# Altium schematic sheet PCB_PROJECT_01.SchDoc
size A4; SheetNumber: 1; SheetTotal: 1
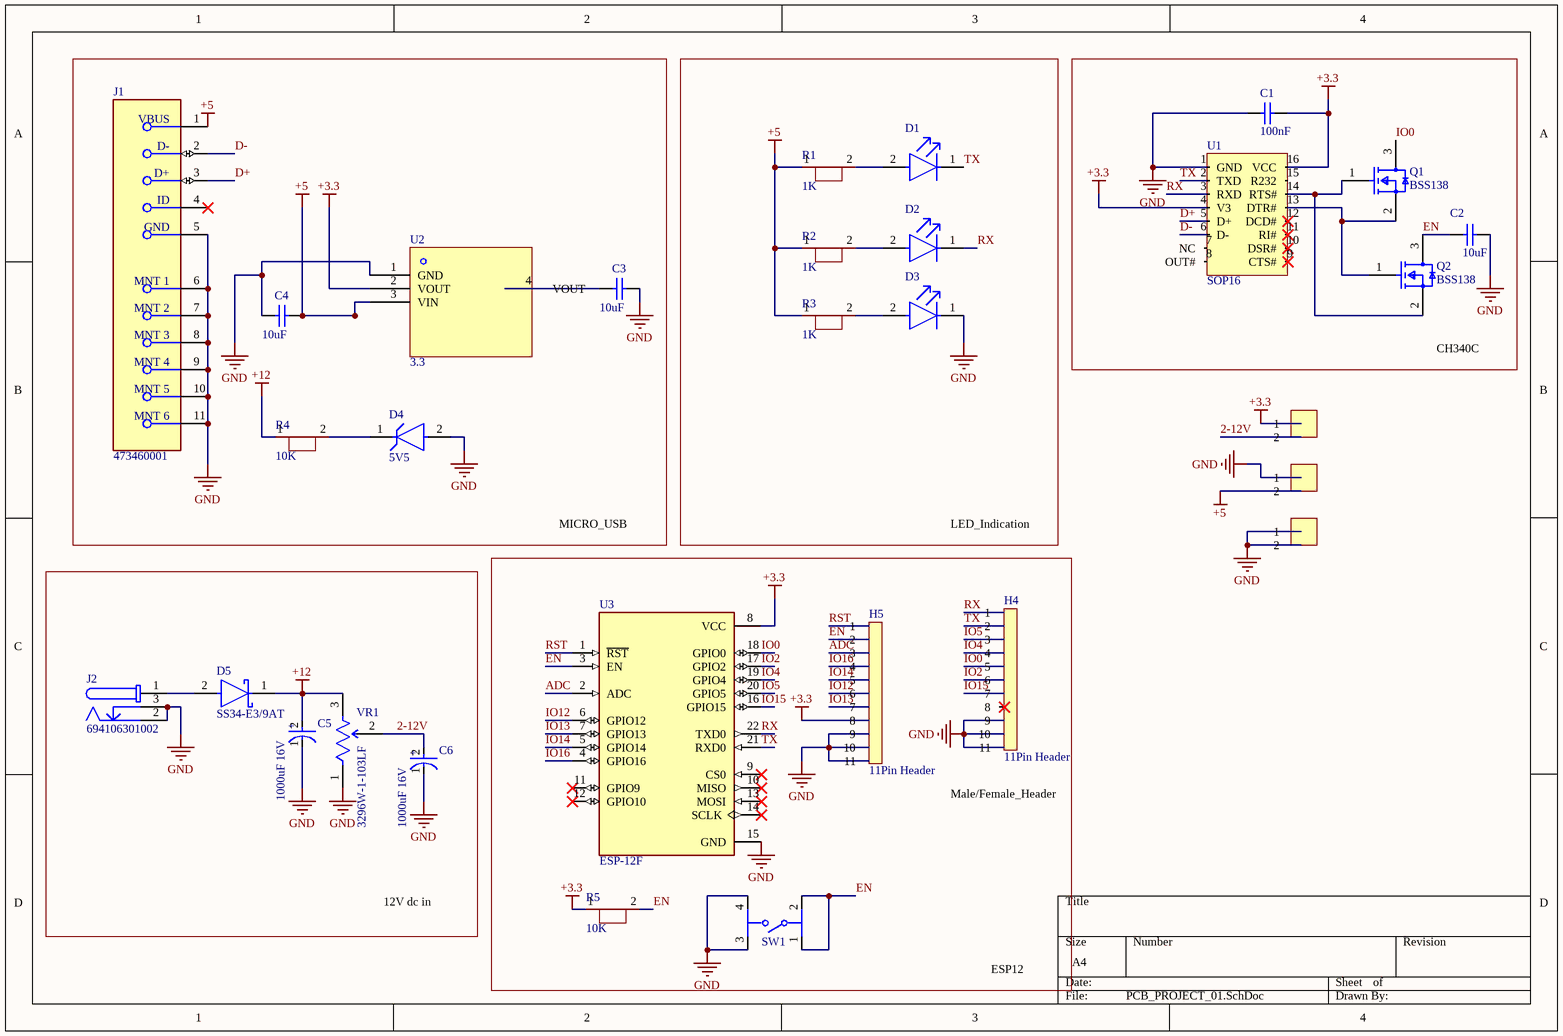
[diagram p0: PCB_PROJECT_01.SchDoc]

## Parts
C1  100nF  [CAPC0805(2012)145_M]
C2  10uF  [CAPC0805(2012)145_M]
C3  10uF  [CAPC0805(2012)100_L]
C4  10uF  [CAPC0805(2012)100_L]
C5  1000uF 16V  [FP-RAD-TH-D_10_0_5-L_16_1-MFG]
C6  1000uF 16V  [FP-RAD-TH-D_10_0_5-L_16_1-MFG]
D1  (no value)  [FP-SML-LX0603SIW-TR-MFG]
D2  SML-LX0603SIW-TR  [FP-SML-LX0603SIW-TR-MFG]  (value not drawn)
D3  SML-LX0603SIW-TR  [FP-SML-LX0603SIW-TR-MFG]  (value not drawn)
D4  5V5  [FP-SOD123-MFG]
D5  SS34-E3/9AT  [FP-SMC-MFG]
H1  HDR_2PIN  [HDR_2PIN]  (value not drawn)
H2  HDR_2PIN  [HDR_2PIN]  (value not drawn)
H3  HDR_2PIN  [HDR_2PIN]  (value not drawn)
H4  11Pin Header  [HDR_11PIN]
H5  11Pin Header  [HDR_11PIN]
J1  473460001  [FP-473460001-MFG]
J2  694106301002  [694106301002]
Q1  BSS138  [FP-318-08-IPC_B]
Q2  BSS138  [FP-318-08-IPC_B]
R1  1K  [RES0805]
R2  1K  [RES0805]
R3  1K  [RES0805]
R4  10K  [RES0805]
R5  10K  [RES0805]
SW1  B3F-1055  [FP-B3F-1055-MFG]  (value not drawn)
U1  SOP16  [CH340C]
U2  3.3  [AMS11173.3]
U3  ESP-12F  [XCVR_ESP-12F]
VR1  3296W-1-103LF  [FP-3296W-MFG]

## Nets
+3.3: C1.2 H1.1 H5.8 R5.1 U1.4(V3) U1.16(VCC) U2.2(VOUT) U3.8(VCC)
+5: C4.2 H2.2 J1.1(VBUS) R1.1 R2.1 R3.1 U2.3(VIN)
+12: C5.2(A) D5.1(C) R4.1 VR1.3(CW)
GND: C1.1 C2.2 C3.2 C4.1 C5.1(C) C6.1(C) D3.1(C) D4.2(A) H2.1 H3.1 H3.2 H4.9 H4.10 H4.11 H5.9 H5.10 H5.11 J1.5(GND) J1.6(MNT_1) J1.7(MNT_2) J1.8(MNT_3) J1.9(MNT_4) J1.10(MNT_5) J1.11(MNT_6) J2.2 J2.3 SW1.3 SW1.4 U1.1(GND) U2.1(GND) U3.15(GND) VR1.1(CCW)
2-12V: C6.2(A) H1.2 VR1.2(WIPER)
ADC: H5.3 U3.2(ADC)
D+: J1.3(D+) U1.5(D+)
D-: J1.2(D-) U1.6(D-)
EN: C2.1 H5.2 Q2.3(D) R5.2 SW1.1 SW1.2 U3.3(EN)
IO0: H4.5 Q1.3(D) U3.18(GPIO0)
IO2: H4.6 U3.17(GPIO2)
IO4: H4.4 U3.19(GPIO4)
IO5: H4.3 U3.20(GPIO5)
IO12: H5.6 U3.6(GPIO12)
IO13: H5.7 U3.7(GPIO13)
IO14: H5.5 U3.5(GPIO14)
IO15: H4.7 U3.16(GPIO15)
IO16: H5.4 U3.4(GPIO16)
RST: H5.1 U3.1(~{RST})
RX: D2.1(C) H4.1 U1.3(RXD) U3.22(TXD0)
TX: D1.1(C) H4.2 U1.2(TXD) U3.21(RXD0)
NetC3_1: C3.1 U2.4(VOUT)
NetD1_2: D1.2(A) R1.2
NetD2_2: D2.2(A) R2.2
NetD3_2: D3.2(A) R3.2
NetD4_1: D4.1(C) R4.2
NetD5_2: D5.2(A) J2.1
NetQ1_1: Q1.1(G) Q2.2(S) U1.14(RTS#)
NetQ1_2: Q1.2(S) Q2.1(G) U1.13(DTR#)

Not connected (* = marked no-connect by the designer): H4 8*; J1 4(ID)*; U1 7(NC) 8(OUT#) 9(CTS#)* 10(DSR#)* 11(RI#)* 12(DCD#)* 15(R232); U3 9(CS0)* 10(MISO)* 11(GPIO9)* 12(GPIO10)* 13(MOSI)* 14(SCLK)*

## Notes on the sheet
- (near Q2) CH340C
- MICRO_USB
- LED_Indication
- (near H4) Male/Female_Header
- 12V dc in
- ESP12
- (in symbol CMP-05427-001094-1) +

## Library data of the parts
C1 C2 = CMP-1036-04429-1: CAP 100nF 100V ±10% 0805 (2012 Metric) Thickness 1.45mm SMD; Tolerance: Â±10%; Case-Metric: 2012; Case-EIA: 0805; Rated Voltage: 100 V; Max Thickness: 1.45 mm; Technology: SMT; Value: 100nF
C3 C4 = CMP-1036-04418-1: Case-EIA: 0805; Tolerance: Â±5%; Case-Metric: 2012; Value: 100nF; Rated Voltage: 50 V; Max Thickness: 1 mm; Technology: SMT
C5 C6 = CMP-05427-001094-1: Aluminum Electrolytic Capacitors (Radial Lead Type) AEC-Q200 Qualified 1000uF ±20% 16V; Dielectric Material: Aluminium; Capacitance: 1mF; Ripple Current: 1.24A; Life (Hours): 4000Hour; Lead Diameter: 0.6mm; Impedance: 49mR; Case/Package: Radial; Max Operating Temperature: 105°C; Diameter: 10mm; Termination: Radial; Series: FK Radial; REACH SVHC: No SVHC; Voltage: 16V; Tolerance: 20%; Min Operating Temperature: -55°C; Packaging: Bulk; Mount: Through Hole; Radiation Hardening: No; Construction: RADIAL; Height: 16mm; RoHS Compliant: Yes; Voltage Rating (DC): 16V; Lead Pitch: 5mm; Number of Pins: 2; Voltage Rating: 16V
D1 = CMP-57192-000009-1: LED RED DIFFUSED SMD; Test Current: 20mA; Forward Voltage: 2V; Approvals: UL; Dominant Wavelength: 636nm; Viewing Angle: 140°; Lens Color: White; Luminous Intensity: 60mcd; Power Rating: 50mW; Number of LEDs: 1; Color: Red; Forward Current: 20mA; Moisture Sensitivity Level: 2; Case Code (Imperial): 0603; Lead Free: Lead Free; Lens Transparency: Diffused; Case Code (Metric): 1608; Height: 0.6mm; Max Operating Temperature: 85°C; Width: 0.8mm; Lens Style: Diffused; Illumination Color: Red; Wavelength: 636nm; REACH SVHC: No SVHC; Package Quantity: 1; RoHS Compliant: Yes; Case/Package: 0603; Number of Pins: 2; Packaging: Tape and Reel; Length: 1.6mm; Mount: Surface Mount; Min Operating Temperature: -25°C
D2 = CMP-57192-000009-1: LED RED DIFFUSED SMD; Test Current: 20mA; Color: GREEN; Forward Voltage: 2V; Approvals: UL; Dominant Wavelength: 636nm; Viewing Angle: 140°; Lens Color: White; Luminous Intensity: 60mcd; Power Rating: 50mW; Number of LEDs: 1; Forward Current: 20mA; Moisture Sensitivity Level: 2; Case Code (Imperial): 0603; Lead Free: Lead Free; Lens Transparency: Diffused; Case Code (Metric): 1608; Height: 0.6mm; Max Operating Temperature: 85°C; Width: 0.8mm; Lens Style: Diffused; Illumination Color: Red; Wavelength: 636nm; REACH SVHC: No SVHC; Package Quantity: 1; RoHS Compliant: Yes; Case/Package: 0603; Number of Pins: 2; Packaging: Tape and Reel; Length: 1.6mm; Mount: Surface Mount; Min Operating Temperature: -25°C
D3 = CMP-57192-000009-1: LED RED DIFFUSED SMD; Test Current: 20mA; Color: YELLOW; Forward Voltage: 2V; Approvals: UL; Dominant Wavelength: 636nm; Viewing Angle: 140°; Lens Color: White; Luminous Intensity: 60mcd; Power Rating: 50mW; Number of LEDs: 1; Forward Current: 20mA; Moisture Sensitivity Level: 2; Case Code (Imperial): 0603; Lead Free: Lead Free; Lens Transparency: Diffused; Case Code (Metric): 1608; Height: 0.6mm; Max Operating Temperature: 85°C; Width: 0.8mm; Lens Style: Diffused; Illumination Color: Red; Wavelength: 636nm; REACH SVHC: No SVHC; Package Quantity: 1; RoHS Compliant: Yes; Case/Package: 0603; Number of Pins: 2; Packaging: Tape and Reel; Length: 1.6mm; Mount: Surface Mount; Min Operating Temperature: -25°C
D4 = CMP-2000-05976-2: DIODE ZENER 5.1V 500MW SOD123; Manufacturer Part Number: BZT52C5V1-7-F; Manufacturer: Diodes Incorporated; Standoff Height: 0mm; Max Reverse Leakage Current: 2uA; Forward Current: 10mA; Power Dissipation: 370mW; Max Zener Voltage: 5.4V; Zener Impedance: 60Ω; Automotive Grade: NA; Max Junction Temp: +150°C; Device Class L3: Zener Diodes; ComponentLink2Description: Datasheet; Mouser Description: Zener Diodes 5.1V 500mW; Octopart: https://octopart.com/bzt52c5v1-7-f-diodes+inc.-326718; Package: SOD123; RoHS: TRUE; Nom Zener Voltage: 5.1V; Device Class L1: Discrete Semiconductors; Lead Free: Yes; Footprint Url: https://www.diodes.com/assets/Package-Files/SOD123.pdf; ComponentLink2URL: https://www.diodes.com/assets/Datasheets/ds18004.pdf; Digikey Description: DIODE ZENER 5.1V 500MW SOD123; Height: 1.45mm; Temperature Range Low: -65°C; Device Class L2: Diodes; Temperature: -65°C to +150°C; Automotive: No; Temperature Range High: +150°C; Category: Diode
D5 = CMP-02539-000066-1: DIODE SCHOTTKY 40V 3A DO214AB; Peak Non-Repetitive Surge Current: 100A; Forward Voltage: 500mV; Element Configuration: Single; Max Reverse Current: 500uA; Case/Package: SMC; Radiation Hardening: No; Series: -; Max Surge Current: 100A; RoHS Compliant: Yes; Min Operating Temperature: -55°C; Average Rectified Current: 3A; Max Reverse Leakage Current: 500uA; Package Quantity: 3500; Max Reverse Voltage (DC): 40V; Forward Current: 3A; Packaging: Tape and Reel; Max Operating Temperature: 125°C; Max Repetitive Reverse Voltage (Vrrm): 40V; Number of Pins: 2; Mount: Surface Mount
H1-H3 = HDR_2PIN: 2-Pin Header
J1 = CMP-2000-05246-2: CONN RCPT USB2.0 MICRO B SMD R/A; Manufacturer: Molex; Conn Orientation: Right Angle; Is Female: yes; Shielding: true; Pitch: 0.65mm; Number Of Contacts: 5; Voltage Rating: 30V; Current Rating: 1.8A; Device Class L2: USB Connectors; Digikey Description: CONN RCPT USB2.0 MICRO B SMD R/A; Height: 2.945mm; RoHS: TRUE; ComponentLink2Description: Datasheet; Octopart: https://octopart.com/47346-0001-molex-7164928; Automotive: No; Package: 0; Category: Conn; Device Class L1: Connectors; Usb Standard: USB 2.0; Temperature: -30°C to +85°C; Temperature Range Low: -30°C; Footprint Url: https://www.molex.com/pdm_docs/sd/473460001_sd.pdf; ComponentLink2URL: https://www.molex.com/webdocs/datasheets/pdf/en-us/0473460001_IO_CONNECTORS.pdf; Lead Free: Yes; Manufacturer Part Number: 473460001; Contact Material: Gold,Nickel; Temperature Range High: +85°C; Device Class L3: unset
J2 = CMP-1502-00188-3: DC Power Jack Connector WR-DC, Male, Right Angled, THT, 5 A, 24 V; Operating Supply Voltage: 24V; Shielding: Unshielded; Current Rating: 5A; Number of Contacts: 3; Insulation Resistance: 100MΩ; Termination: Through Hole; RoHS: Compliant; Contact Plating: Tin; Connector Type: Power; Contact Material: Gold, Tin; Packaging: Bulk; Min Operating Temperature: -40°C; REACH SVHC: Unknown; Housing Material: Polyamide; Contact Gender: Female; Height: 11mm; Gender: Male; Color: Black; Voltage Rating: 24V; Flammability Rating: UL94 V-0; Max Operating Temperature: 85°C; Mount: Through Hole
Q1 Q2 = CMP-07173-000101-1: MOSFET N-CH 50V 220MA SOT-23; Turn-Off Delay Time: 20ns; Element Configuration: Single; Rds On Max: 3.5R; Gate to Source Voltage (Vgs): 20V; Threshold Voltage: 1.3V; Number of Elements: 1; Power Dissipation: 360mW; Rise Time: 9ns; Turn-On Delay Time: 2.5ns; Input Capacitance: 27pF; On-State Resistance: 6R; Lead Free: Lead Free; Length: 2.92mm; Width: 1.3mm; Drain to Source Breakdown Voltage: 50V; Min Operating Temperature: -55°C; REACH SVHC: No SVHC; Packaging: Tape and Reel; Radiation Hardening: No; Height: 0.93mm; Drain to Source Voltage (Vdss): 50V; Current Rating: 220mA; Voltage Rating (DC): 50V; Weight: 0.03g; Continuous Drain Current (ID): 220mA; Number of Pins: 3; Nominal Vgs: 1.3V; Max Power Dissipation: 360mW; Fall Time: 9ns; Drain to Source Resistance: 3.5R; Contact Plating: Tin; Case/Package: SOT-23; Package Quantity: 1; Dual Supply Voltage: 50V; Mount: Surface Mount; Termination: SMD/SMT; Max Operating Temperature: 150°C
R1-R5 = RES0805
SW1 = CMP-08834-000061-1: SWITCH TACTILE SPST-NO 0.05A 24V; Switch Travel: 0.25mm; Mechanical Life: 100000Cycles; Max Current Rating: 50mA; Actuator Color: Orange; Throw Configuration: SPST; Switch Function: Off-Mom; Contact Resistance: 100mR; Number of Poles: 1; Operating Force: 2.55N; Illumination Type: Non-Illuminated; Electrical Life: 300000Cycles; Actuator Length: 3mm; Termination: PC Pins; Contact Plating: Silver; Depth: 6mm; Max Voltage Rating (DC): 24V; Voltage Rating (DC): 24V; Package Quantity: 1500; Lead Free: Lead Free; Min Operating Temperature: -25°C; Max Operating Temperature: 70°C; Mount: Through Hole; Series: B3F; Contact Current Rating: 50mA; Orientation: Straight; Width: 6mm; RoHS Compliant: Yes; Contact Type: 1 maker; Weight: 0.25g; Packaging: Bag; Contact Material: Gold; Length: 6mm; Height: 7.3mm; Current Rating: 50mA
U1 = CH3400C
U2 = AMS11173.3: 3LEAD SOT-223 PLASTIC PACKAGE
U3 = ESP-12F: WiFi Module; MF: AI-Thinker; SnapEDA_Link: https://www.snapeda.com/parts/ESP-12F/AI-Thinker/view-part/?ref=snap; Package: Package; Value: *; MP: ESP-12F; Check_prices: https://www.snapeda.com/parts/ESP-12F/AI-Thinker/view-part/?ref=eda
VR1 = CMP-1747-00001-8: TRIMMER 10K OHM 0.5W PC PIN TOP; Number of Turns: 25; Tolerance: 10%; Resistance: 10kR; Max Power Dissipation: 500mW; Temperature Coefficient: 100ppm/°C; Insulation Resistance: 1GR; Min Operating Temperature: -55°C; Resistor Type: Cermet; Series: 3296; Color: Blue; Mount: Through Hole; Taper: Linear; Radiation Hardening: No; RoHS Compliant: Yes; Width: 9.53mm; Resistance Tolerance: 10%; Contact Plating: Tin; Military Standard: Not; Package Quantity: 50; Weight: 0.03oz; Lead Free: Lead Free; Power Rating: 500mW; Termination: Pin; Technology: CERMET; Max Operating Temperature: 125°C; Packaging: Rail/Tube; Length: 9.53mm; Depth: 4.83mm; Height: 11.55mm; Reach SVHC Compliant: Yes